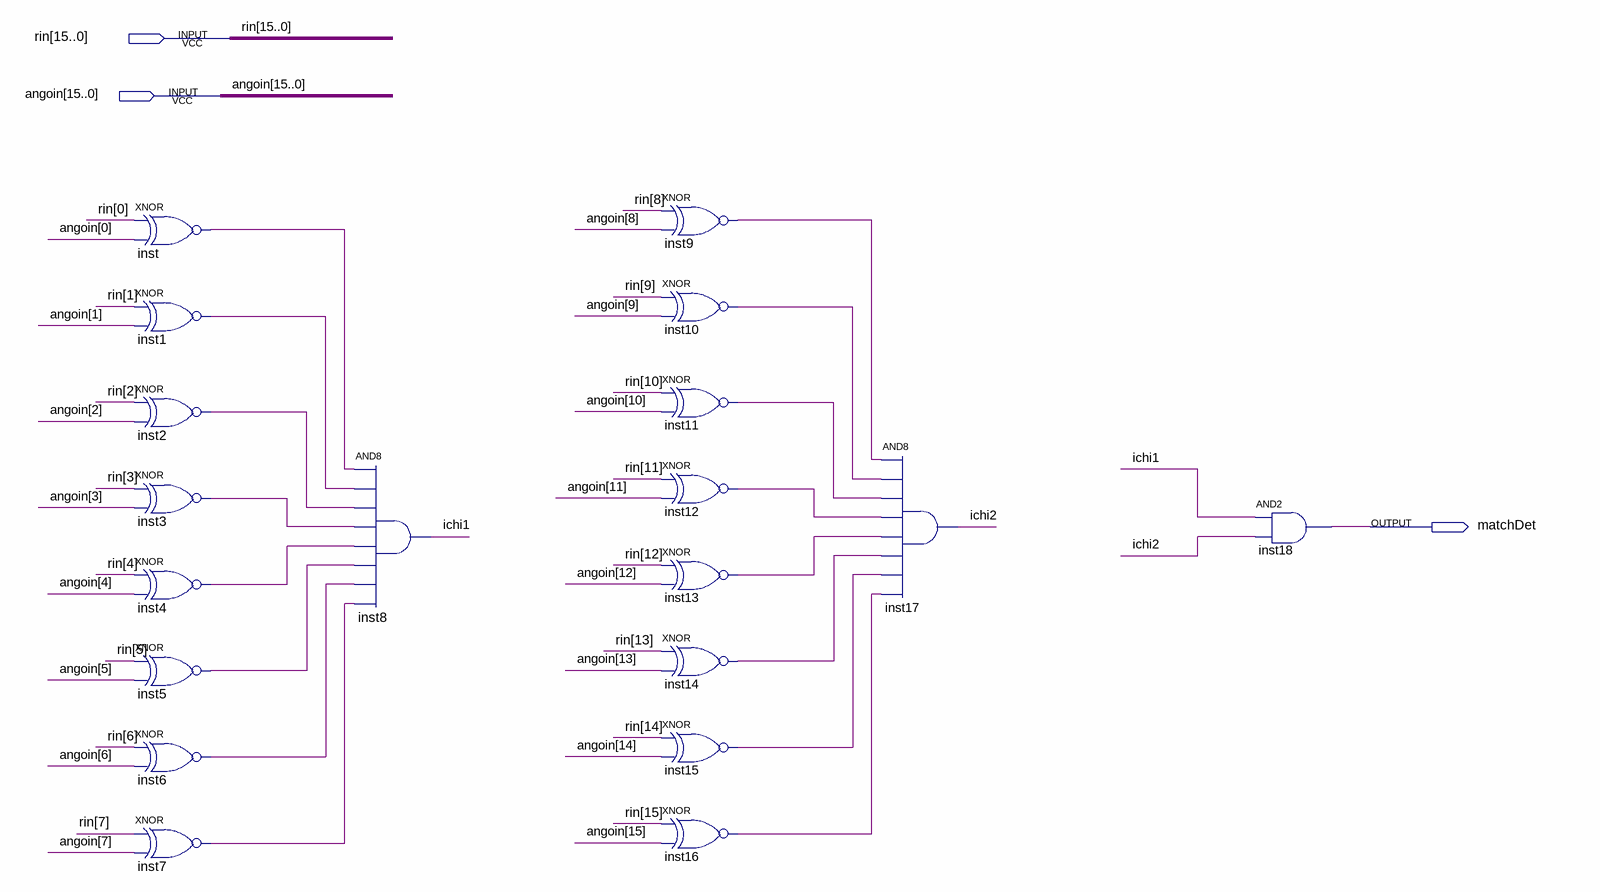
[diagram p0: schematic sheet]
// Quartus schematic detectModule.bdf as structural Verilog: 19 symbols, 3 pins
module detectModule (
  input  [15:0] rin,
  input  [15:0] angoin,
  output matchDet
);

  wire ichi1, ichi2, inst1_out, inst2_out, inst3_out, inst4_out, inst5_out, inst6_out, inst7_out, inst9_out,
       inst10_out, inst11_out, inst12_out, inst13_out, inst14_out, inst15_out, inst16_out, inst_out;

  xnor inst (inst_out, rin[0], angoin[0]);
  xnor inst1 (inst1_out, rin[1], angoin[1]);
  xnor inst2 (inst2_out, rin[2], angoin[2]);
  xnor inst3 (inst3_out, rin[3], angoin[3]);
  xnor inst4 (inst4_out, rin[4], angoin[4]);
  xnor inst5 (inst5_out, rin[5], angoin[5]);
  xnor inst6 (inst6_out, rin[6], angoin[6]);
  xnor inst7 (inst7_out, rin[7], angoin[7]);
  and inst8 (ichi1, inst_out, inst1_out, inst2_out, inst3_out, inst4_out, inst5_out, inst6_out, inst7_out);
  xnor inst9 (inst9_out, rin[8], angoin[8]);
  xnor inst10 (inst10_out, rin[9], angoin[9]);
  xnor inst11 (inst11_out, rin[10], angoin[10]);
  xnor inst12 (inst12_out, rin[11], angoin[11]);
  xnor inst13 (inst13_out, rin[12], angoin[12]);
  xnor inst14 (inst14_out, rin[13], angoin[13]);
  xnor inst15 (inst15_out, rin[14], angoin[14]);
  xnor inst16 (inst16_out, rin[15], angoin[15]);
  and inst17 (ichi2, inst9_out, inst10_out, inst11_out, inst12_out, inst13_out, inst14_out, inst15_out, inst16_out);
  and inst18 (matchDet, ichi1, ichi2);
endmodule
